# EAGLE design levelshifter (EAGLE 6.6.0)
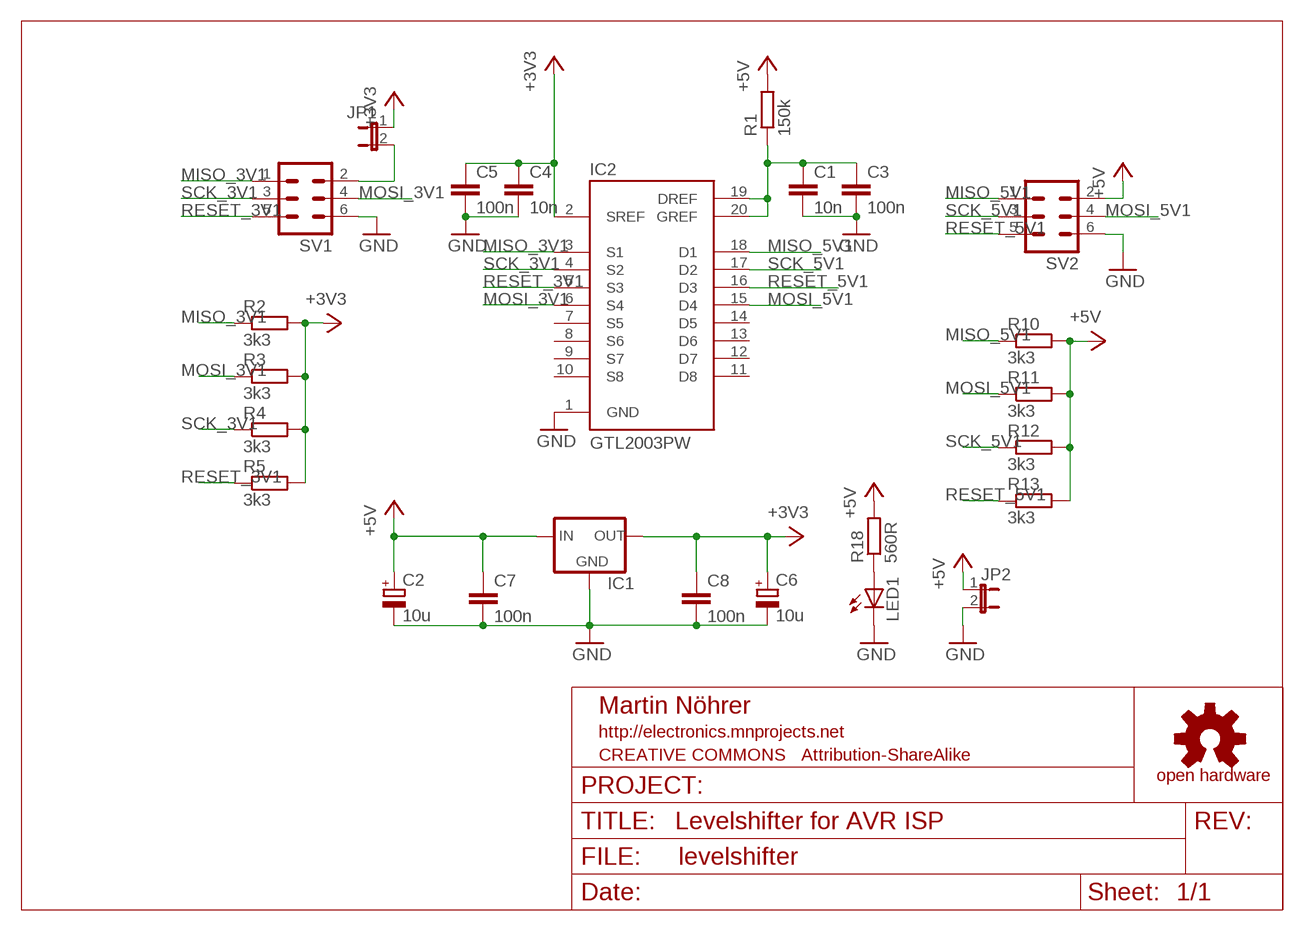
[diagram p0: schematic, sheet 1]

## Parts
C1  10n  C-EUC1206  [C1206]
C2  10u  CPOL-EUSMCC  [SMC_C]
C3  100n  C-EUC1206  [C1206]
C4  10n  C-EUC1206  [C1206]
C5  100n  C-EUC1206  [C1206]
C6  10u  CPOL-EUSMCC  [SMC_C]
C7  100n  C-EUC1206  [C1206]
C8  100n  C-EUC1206  [C1206]
IC1  LM1117  [SOT223]
IC2  GTL2003PW  [TSSOP20]
JP1  JP1E  [JP1]
JP2  JP1E  [JP1]
LED1  LEDSMT1206  [1206]
R1  150k  R-EU_R1206  [R1206]
R2  3k3  R-EU_R1206  [R1206]
R3  3k3  R-EU_R1206  [R1206]
R4  3k3  R-EU_R1206  [R1206]
R5  3k3  R-EU_R1206  [R1206]
R10  3k3  R-EU_R1206  [R1206]
R11  3k3  R-EU_R1206  [R1206]
R12  3k3  R-EU_R1206  [R1206]
R13  3k3  R-EU_R1206  [R1206]
R18  560R  R-EU_R1206  [R1206]
SV1  ML6  [ML6]
SV2  ML6  [ML6]

## Nets
+3V3: C4.1 C5.1 C6.+ C8.1 IC1.2(OUT) IC2.2(SREF) JP1.1 R2.2 R3.2 R4.2 R5.2
+5V: C2.+ C7.1 IC1.3(IN) JP2.1 R1.2 R10.2 R11.2 R12.2 R13.2 R18.2 SV2.2
GND: C1.2 C2.- C3.2 C4.2 C5.2 C6.- C7.2 C8.2 IC1.1(GND) IC2.1(GND) JP2.2 LED1.C SV1.6 SV2.6
MISO_3V1: IC2.3(S1) R2.1 SV1.1
MISO_5V1: IC2.18(D1) R10.1 SV2.1
MOSI_3V1: IC2.6(S4) R3.1 SV1.4
MOSI_5V1: IC2.15(D4) R11.1 SV2.4
N$1: JP1.2 SV1.2
N$2: C1.1 C3.1 IC2.19(DREF) IC2.20(GREF) R1.1
N$3: LED1.A R18.1
RESET_3V1: IC2.5(S3) R5.1 SV1.5
RESET_5V1: IC2.16(D3) R13.1 SV2.5
SCK_3V1: IC2.4(S2) R4.1 SV1.3
SCK_5V1: IC2.17(D2) R12.1 SV2.3
Unconnected: IC2.7(S5) IC2.8(S6) IC2.9(S7) IC2.10(S8) IC2.11(D8) IC2.12(D7) IC2.13(D6) IC2.14(D5)

## Notes on the sheet
- Levelshifter for AVR ISP

## Library data of the parts
C1 C3-C5 C7 C8 = rcl:C-EU: CAPACITOR, European symbol
C2 C6 = rcl:CPOL-EU: POLARIZED CAPACITOR, European symbol
IC1 = v-reg-3:LM1117
IC2 = nxp_martin:GTL2003
JP1 JP2 = jumper:JP1E: JUMPER
LED1 = led:LED: LED OSRAM: - CHIPLED LG R971, LG N971, LY N971, LG Q971, LY Q971, LO R971, LY R971 LH N974, LH R974 LS Q976, LO Q976, LY Q976 LO Q996 - Hyper CHIPLED LW Q18S LB Q993, LB Q99A, LB R99A - SideLED LS A670, LO A670, LY A670, LG A670, LP A670 LB A673, LV A673, LT A673, LW A673 LH A674 LY A675 LS A676, LA A676, LO A676, LY A676, LW A676 LS A679, LY A679, LG A679 - Hyper Micro SIDELED® LS Y876, LA Y876, LO Y876, LY Y876 LT Y87S - SmartLED LW L88C, LW L88S LB L89C, LB L89S, LG L890 LS L89K, LO L89K, LY L89K LS L896, LA L896, LO L896, LY L896 - TOPLED LS T670, LO T670, LY T670, LG T670, LP T670 LSG T670, LSP T670, LSY T670, LOP T670, LYG T670 LG T671, LOG T671, LSG T671 LB T673, LV T673, LT T673, LW T673 LH T674 LS T676, LA T676, LO T676, LY T676, LB T676, LH T676, LSB T676, LW T676 LB T67C, LV T67C, LT T67C, LS T67K, LO T67K, LY T67K, LW E67C LS E67B, LA E67B, LO E67B, LY E67B, LB E67C, LV E67C, LT E67C LW T67C LS T679, LY T679, LG T679 LS T770, LO T770, LY T770, LG T770, LP T770 LB T773, LV T773, LT T773, LW T773 LH T774 LS E675, LA E675, LY E675, LS T675 LS T776, LA T776, LO T776, LY T776, LB T776 LHGB T686 LT T68C, LB T68C - Hyper Mini TOPLED® LB M676 - Mini TOPLED Santana® LG M470 LS M47K, LO M47K, LY M47K Source: http://www.osram.convergy.de LUXEON: - LUMILED® LXK2-PW12-R00, LXK2-PW12-S00, LXK2-PW14-U00, LXK2-PW14-V00 LXK2-PM12-R00, LXK2-PM12-S00, LXK2-PM14-U00 LXK2-PE12-Q00, LXK2-PE12-R00, LXK2-PE12-S00, LXK2-PE14-T00, LXK2-PE14-U00 LXK2-PB12-K00, LXK2-PB12-L00, LXK2-PB12-M00, LXK2-PB14-N00, LXK2-PB14-P00, LXK2-PB14-Q00 LXK2-PR12-L00, LXK2-PR12-M00, LXK2-PR14-Q00, LXK2-PR14-R00 LXK2-PD12-Q00, LXK2-PD12-R00, LXK2-PD12-S00 LXK2-PH12-R00, LXK2-PH12-S00 LXK2-PL12-P00, LXK2-PL12-Q00, LXK2-PL12-R00 Source: www.luxeon.com KINGBRIGHT: KA-3528ASYC Source: www.kingbright.com
R1-R5 R10-R13 R18 = rcl:R-EU_: RESISTOR, European symbol
SV1 SV2 = con-harting-ml:ML6: HARTING

## Board
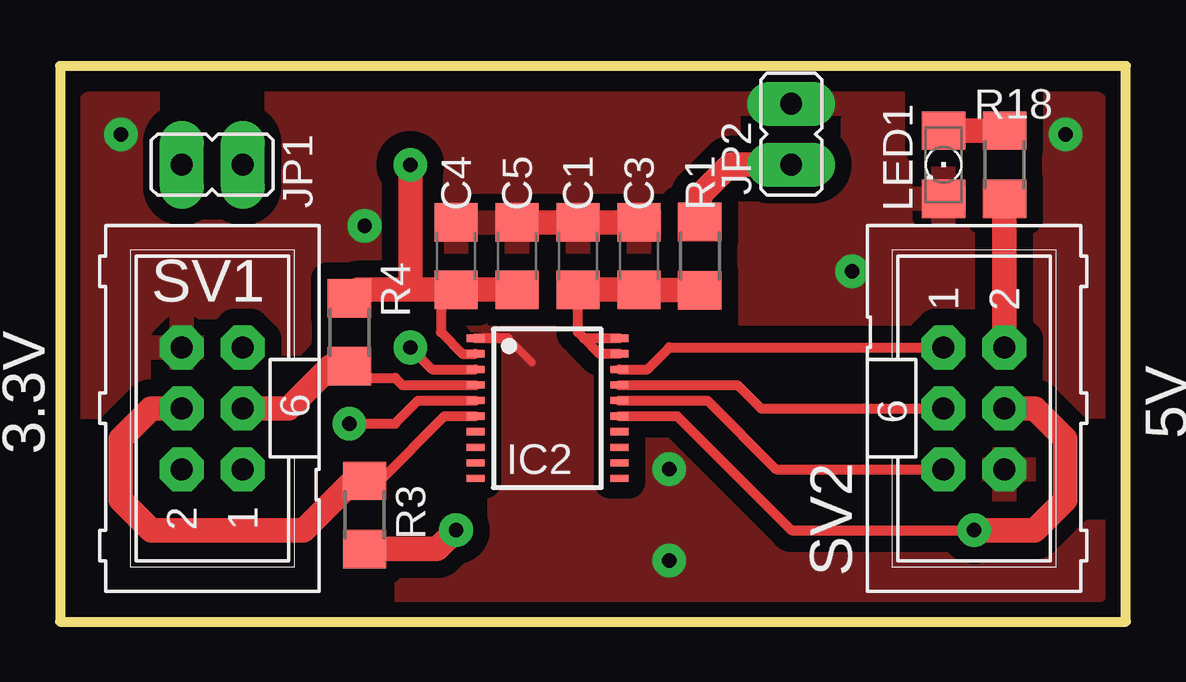
[diagram p1: board, top side]
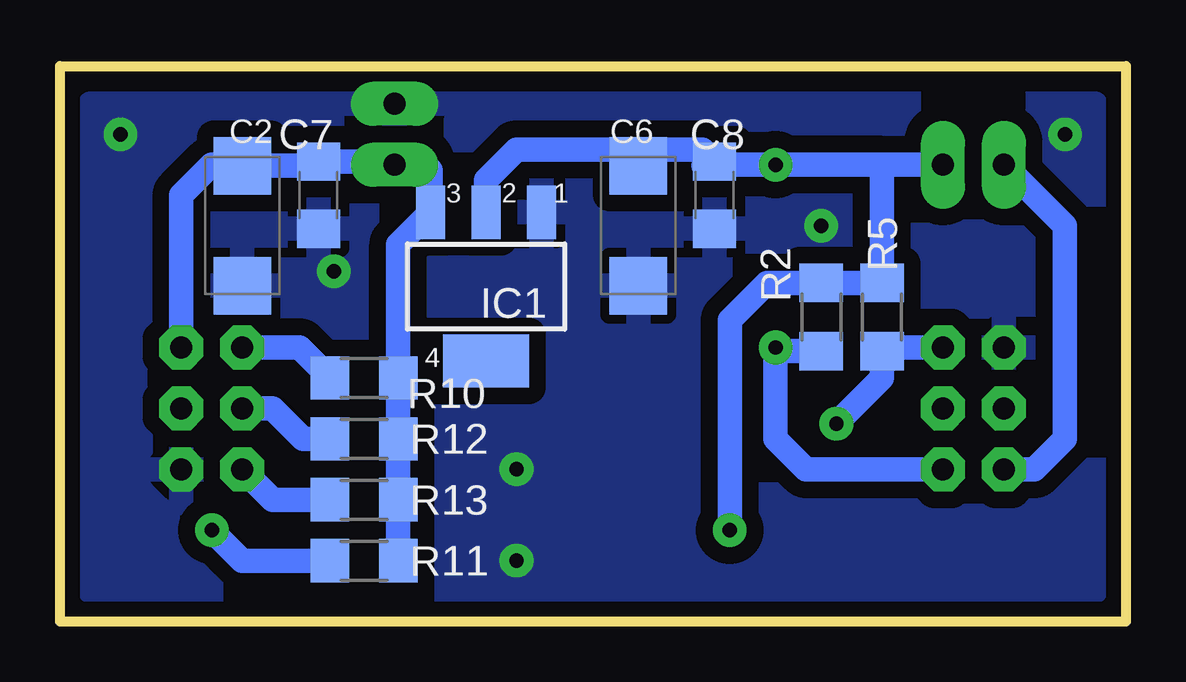
[diagram p2: board, bottom side, seen from below]

Size 44.43 x 23.16 mm. Coordinates in mm from the lower left corner, seen from the top.
Outline: 0,0 44.43,0 44.43,23.16 0,23.16 0,0
Copper layers (1*16): Top 0.035mm / dielectric 1.5mm / Bottom 0.035mm
Design rules "hobby2-bigger *": minimum track width 0.8mm, minimum drill 0.8mm, track to track 0.7mm, track to pad 0.7mm, pad to pad 0.45mm, via to via 0.7mm, smd to smd 8mil, copper to edge 25mil, drill to drill 8mil, minimum pad ring 0.4mm, minimum via ring 0.4mm, stop-mask expansion 0mil, vias tented up to drill 0mil, thermal gap 15mil

### Footprints (pad centres in the part's own frame; a part is rotated, then mirrored left to right if it is on the bottom)
C1206 = smd 1.6 x 1.8: 1 -1.4,0; 2 1.4,0
SMC_C = smd 2.4 x 2.4: + -2.5,0; - 2.5,0
SOT223 = smd 1.219 x 2.235: 1 -2.311,-3.099; 2 0,-3.099; 3 2.311,-3.099 | smd 3.6 x 2.2: 4 0,3.099
TSSOP20 = smd 0.3 x 0.75: 1 -2.925,-3; 2 -2.275,-3; 3 -1.625,-3; 4 -0.975,-3; 5 -0.325,-3; 6 0.325,-3; 7 0.975,-3; 8 1.625,-3; 9 2.275,-3; 10 2.925,-3; 11 2.925,3; 12 2.275,3; 13 1.625,3; 14 0.975,3; 15 0.325,3; 16 -0.325,3; 17 -0.975,3; 18 -1.625,3; 19 -2.275,3; 20 -2.925,3
JP1 = drill 0.914 long: 1 0,-1.27; 2 0,1.27
1206 = smd 1.6 x 1.803: A -1.422,0; C 1.422,0
R1206 = smd 1.6 x 1.803: 1 -1.422,0; 2 1.422,0
ML6 = drill 0.914 octagon: 1 -2.54,-1.27; 2 -2.54,1.27; 3 0,-1.27; 4 0,1.27; 5 2.54,-1.27; 6 2.54,1.27

### Placement (x,y rotation side)
C1  21.59,15.24 90 top
C2  36.83,16.51 270 bottom
C3  24.13,15.24 90 top
C4  16.51,15.24 90 top
C5  19.05,15.24 90 top
C6  20.32,16.51 270 bottom
C7  33.66,17.78 270 bottom
C8  17.14,17.78 270 bottom
IC1  26.67,13.97 180 bottom
IC2  20.32,8.89 270 top
JP1  6.35,19.05 90 top
JP2  30.48,20.32 0 top
LED1  36.83,19.05 270 top
R1  26.67,15.24 90 top
R2  12.7,12.7 90 bottom
R3  12.7,4.45 270 top
R4  12.06,12.06 90 top
R5  10.16,12.7 90 bottom
R10  31.75,10.16 0 bottom
R11  31.75,2.54 0 bottom
R12  31.75,7.62 0 bottom
R13  31.75,5.08 0 bottom
R18  39.37,19.05 270 top
SV1  6.35,8.89 90 top
SV2  38.1,8.89 270 top

### Tracks (layer width: path | path; a pad name or v marks a point on that pad's centre or on a via)
+3V3  (via drill 0.6)
  Top 0.305: C4.1 15.88,13.21
  Top 0.406: IC2.2 16.78,11.16 15.88,12.06 15.88,13.21
  Top 1.016: C5.1 C4.1 14.61,13.84 | R4.2 12.42,13.84 14.61,13.84 | R3.2 15.72,3.02 v16.51,3.81 | v14.61,19.05 14.61,13.84
  Bottom 1.016: C8.1 17.61,19.01 | 10.16,19.05 JP1.1 | 10.16,19.05 R5.2 R2.2 14.96,14.12 16.51,12.57 v16.51,3.81 | 10.16,19.05 v14.61,19.05 16.38,19.05 C8.1 | IC1.2 26.67,18.41 25.4,19.68 20.32,19.68 | 20.32,19.68 17.65,19.68 C8.1 | 20.32,19.68 C6.+
+5V
  Top 1.016: SV2.2 R18.2 | R1.2 26.67,17.78 27.94,19.05 JP2.1
  Bottom 1.016: C2.+ 35.73,19.01 | R11.2 R13.2 R12.2 R10.2 30.33,15.72 IC1.3 28.98,18.82 29.21,19.05 JP2.1 30.61,19.18 C7.1 33.83,19.01 C2.+ | SV2.2 39.37,17.78 38.1,19.05 36.87,19.05 C2.+
GND  (via drill 0.6)
  Top 0.305: 18.66,11.81 19.68,10.79
  Top 0.406: IC2.1 18.66,11.81
  Top 1.016: C3.2 C1.2 C5.2
  other vias: 33.02,14.61 12.7,16.51 25.4,6.35 25.4,2.54 41.91,20.32 2.54,20.32
  pour Bottom: 1.27,21.59 43.18,21.59 43.18,1.27 1.27,1.27
  pour Top: 1.27,21.59 43.18,21.59 43.18,1.27 1.27,1.27
MISO_3V1  (via drill 0.6)
  Top 0.406: IC2.3 15.52,10.51 v14.61,11.43
  Bottom 1.016: SV1.1 13.33,6.35 14.61,7.62 v14.61,11.43 14.45,11.28 R2.1
MISO_5V1
  Top 0.406: IC2.18 24.48,10.51 25.4,11.43 SV2.1
  Bottom 1.016: R10.1 34.44,11.43 SV2.1
MOSI_3V1
  Top 0.406: IC2.6 16.03,8.56 13.33,5.87 R3.1
  Top 1.016: R3.1 12.22,5.87 10.16,3.81 3.81,3.81 2.54,5.08 2.54,7.62 3.81,8.89 SV1.4
MOSI_5V1  (via drill 0.6)
  Top 0.406: IC2.15 25.72,8.56 30.48,3.81 v38.1,3.81
  Top 1.016: v38.1,3.81 40.64,3.81 41.91,5.08 41.91,7.62 40.64,8.89 SV2.4
  Bottom 1.016: R11.1 36.83,2.54 v38.1,3.81
N$1
  Bottom 1.016: JP1.2 2.54,16.51 2.54,7.62 3.81,6.35 SV1.2
N$2
  Top 0.406: IC2.19 22.49,11.16 21.84,11.81 | C1.1 21.59,12.06 21.84,11.81 | 21.84,11.81 IC2.20
  Top 1.016: C1.1 C3.1 24.15,13.82 R1.1
N$3
  Top 1.016: LED1.A R18.1
RESET_3V1  (via drill 0.6)
  Top 0.406: IC2.5 14.93,9.21 13.97,8.26 v12.06,8.26
  Bottom 1.016: SV1.5 10.01,11.43 R5.1 10.16,10.16 v12.06,8.26
RESET_5V1
  Top 0.406: IC2.16 26.98,9.21 29.84,6.35 SV2.5
  Bottom 1.016: R13.1 35.56,5.08 SV2.5
SCK_3V1
  Top 0.406: IC2.4 14.26,9.87 13.97,10.16 12.55,10.16 R4.1
  Top 1.016: SV1.3 9.53,8.89 11.28,10.64 R4.1
SCK_5V1
  Top 0.406: IC2.17 28.23,9.87 29.21,8.89 SV2.3
  Bottom 1.016: R12.1 34.29,7.62 35.56,8.89 SV2.3

### Text on the board
tPlace: 3.3V | 5V